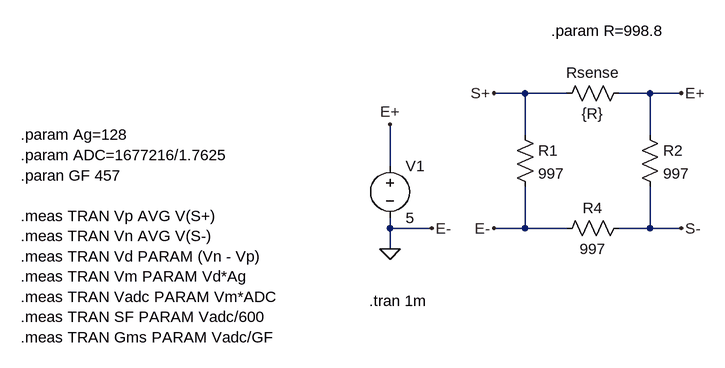
[diagram p0: schematic Wheatstone Bridge.asc]
Wheatstone Bridge.asc, the LTspice schematic file:
Version 4
SHEET 1 1624 736
WIRE 112 80 64 80
WIRE 176 80 112 80
WIRE 304 80 256 80
WIRE 352 80 304 80
WIRE 112 144 112 80
WIRE 304 144 304 80
WIRE -96 192 -96 128
WIRE -96 288 -96 272
WIRE -32 288 -96 288
WIRE 112 288 112 224
WIRE 112 288 64 288
WIRE 176 288 112 288
WIRE 304 288 304 224
WIRE 304 288 256 288
WIRE 352 288 304 288
WIRE -96 320 -96 288
FLAG 352 80 E+
FLAG 64 288 E-
FLAG 64 80 S+
FLAG 352 288 S-
FLAG -96 320 0
FLAG -96 128 E+
FLAG -32 288 E-
SYMBOL res 96 128 R0
SYMATTR InstName R1
SYMATTR Value 997
SYMBOL res 288 128 R0
SYMATTR InstName R2
SYMATTR Value 997
SYMBOL res 272 64 R90
WINDOW 0 0 56 VBottom 2
WINDOW 3 32 56 VTop 2
SYMATTR InstName Rsense
SYMATTR Value {R}
SYMBOL res 272 272 R90
WINDOW 0 0 56 VBottom 2
WINDOW 3 32 56 VTop 2
SYMATTR InstName R4
SYMATTR Value 997
SYMBOL voltage -96 176 R0
WINDOW 123 0 0 Left 2
WINDOW 39 0 0 Left 2
SYMATTR InstName V1
SYMATTR Value 5
TEXT -128 400 Left 2 !.tran 1m
TEXT 152 -16 Left 2 !.param R=998.8
TEXT -664 144 Left 2 !.param Ag=128\n.param ADC=1677216/1.7625\n.paran GF 457\n \n.meas TRAN Vp AVG V(S+)\n.meas TRAN Vn AVG V(S-)\n.meas TRAN Vd PARAM (Vn - Vp) \n.meas TRAN Vm PARAM Vd*Ag\n.meas TRAN Vadc PARAM Vm*ADC\n.meas TRAN SF PARAM Vadc/600\n.meas TRAN Gms PARAM Vadc/GF

The netlist it stands for:
* Wheatstone Bridge.asc
R1 S+ 0 997
R2 E+ S- 997
Rsense E+ S+ {R}
R4 S- 0 997
V1 E+ 0 5
.tran 1m
.param R=998.8
.param Ag=128
.param ADC=1677216/1.7625
.paran GF 457
.meas TRAN Vp AVG V(S+)
.meas TRAN Vn AVG V(S-)
.meas TRAN Vd PARAM (Vn - Vp)
.meas TRAN Vm PARAM Vd*Ag
.meas TRAN Vadc PARAM Vm*ADC
.meas TRAN SF PARAM Vadc/600
.meas TRAN Gms PARAM Vadc/GF
.backanno
.end